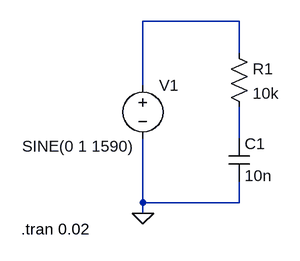
[diagram p0: schematic lab2_lab_procedure.asc]
lab2_lab_procedure.asc, the LTspice schematic file:
Version 4
SHEET 1 880 680
WIRE 320 48 176 48
WIRE 320 96 320 48
WIRE 176 144 176 48
WIRE 320 224 320 176
WIRE 176 320 176 224
WIRE 320 320 320 288
WIRE 320 320 176 320
WIRE 176 336 176 320
FLAG 176 336 0
SYMBOL voltage 176 128 R0
WINDOW 3 -181 108 Left 2
WINDOW 123 0 0 Left 0
WINDOW 39 0 0 Left 0
SYMATTR InstName V1
SYMATTR Value SINE(0 1 1590)
SYMBOL res 304 80 R0
SYMATTR InstName R1
SYMATTR Value 10k
SYMBOL cap 304 224 R0
SYMATTR InstName C1
SYMATTR Value 10n
TEXT -6 360 Left 2 !.tran 0.02

The netlist it stands for:
* lab2_lab_procedure.asc
V1 N001 0 SINE(0 1 1590)
R1 N001 N002 10k
C1 N002 0 10n
.tran 0.02
.backanno
.end